# EAGLE design pdb_v2 (EAGLE 9.4.2)
Robot power distribution board v2.0. Provides stable 5V and 3.3V rails, a direct power output, and I2C expansion.
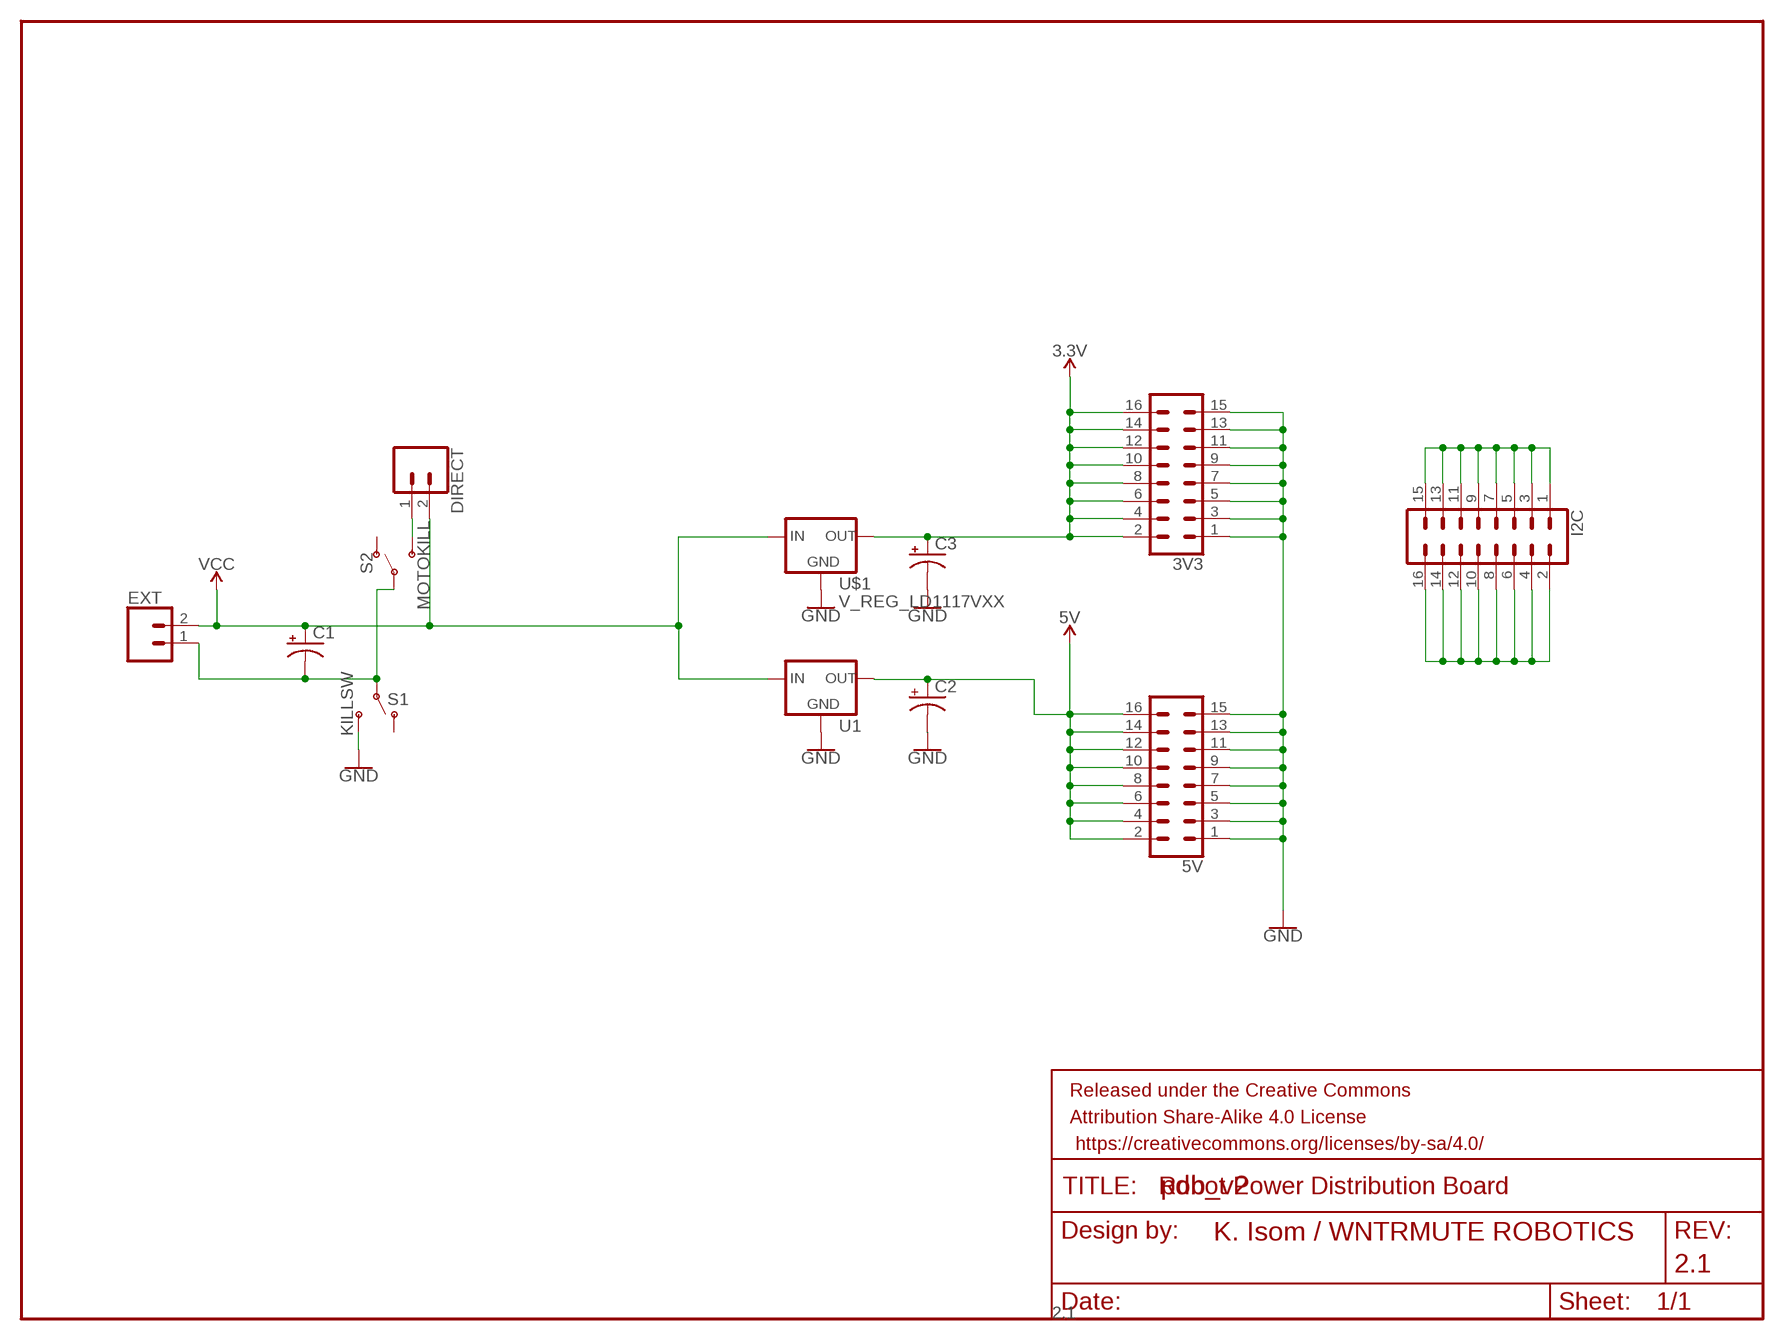
[diagram p0: schematic, sheet 1]

## Parts
3V3  CONN_08X2_HEADER  [2X8]
5V  CONN_08X2_HEADER  [2X8]
C1  1000µF  CPOL-USE5-10.5  [E5-10,5]
C2  100uF  CPOL-USE5-8.5  [E5-8,5]
C3  100uF  CPOL-USE5-8.5  [E5-8,5]
DIRECT  CONN_025MM  [SCREWTERMINAL-5MM-2]
EXT  CONN_025MM  [SCREWTERMINAL-5MM-2]
FRAME1  FRAME-LETTERNO_PACKAGE  [DUMMY]
I2C  CONN_08X2_HEADER  [2X8]
S1  KILLSW  SWITCH-SPDT-PTH-11.6X4.0MM-LOCK  [SWITCH_SPDT_PTH_11.6X4.0MM_LOCK]
S2  MOTOKILL  SWITCH-SPDT-PTH-11.6X4.0MM-LOCK  [SWITCH_SPDT_PTH_11.6X4.0MM_LOCK]
U1  V_REG_78XX-TO-220  [TO-220-ALT]
U$1  V_REG_LD1117VXX  [78XXL]

## Nets
3.3V: 3V3.2 3V3.4 3V3.6 3V3.8 3V3.10 3V3.12 3V3.14 3V3.16 C3.+ U$1.GND(OUT)
5V: 5V.2 5V.4 5V.6 5V.8 5V.10 5V.12 5V.14 5V.16 C2.+ U1.OUT
GND: 3V3.1 3V3.3 3V3.5 3V3.7 3V3.9 3V3.11 3V3.13 3V3.15 5V.1 5V.3 5V.5 5V.7 5V.9 5V.11 5V.13 5V.15 C2.- C3.- S1.3(S) U1.GND U$1.IN(GND)
N$1: C1.- EXT.1 S1.2(P) S2.2(P)
N$7: I2C.1 I2C.3 I2C.5 I2C.7 I2C.9 I2C.11 I2C.13 I2C.15
N$9: I2C.2 I2C.4 I2C.6 I2C.8 I2C.10 I2C.12 I2C.14 I2C.16
N$11: DIRECT.1 S2.3(S)
VCC: C1.+ DIRECT.2 EXT.2 U1.IN U$1.OUT(IN)
Unconnected: S1.1(O) S2.1(O)

## Notes on the sheet
- Robot Power Distribution Board

## Library data of the parts
3V3 5V I2C = SparkFun-Connectors:CONN_08X2: Multi connection point. Often used as Generic Header-pin footprint for 0.1 inch spaced/style header connections You can populate with any combo of single row headers, but if you'd like an exact match, check this: Header - 2x8 (Male, 0.1") <https://www.sparkfun.com/products/13156> (PRT-13156) On any of the 0.1 inch spaced packages, you can populate with these: Break Away Headers - Straight <https://www.sparkfun.com/products/116> (PRT-00116) Break Away Male Headers - Right Angle <https://www.sparkfun.com/products/553> (PRT-00553) Female Headers <https://www.sparkfun.com/products/115> (PRT-00115) Break Away Headers - Machine Pin <https://www.sparkfun.com/products/117> (PRT-00117) Break Away Female Headers - Swiss Machine Pin <https://www.sparkfun.com/products/743> (PRT-00743)
C1-C3 = rcl:CPOL-US: POLARIZED CAPACITOR, American symbol; SPICEPREFIX: C
DIRECT EXT = SparkFun-Connectors:CONN_02: Multi connection point. Often used as Generic Header-pin footprint for 0.1 inch spaced/style header connections On any of the 0.1 inch spaced packages, you can populate with these: Break Away Headers - Straight <https://www.sparkfun.com/products/116> (PRT-00116) Break Away Male Headers - Right Angle <https://www.sparkfun.com/products/553> (PRT-00553) Female Headers <https://www.sparkfun.com/products/115> (PRT-00115) Break Away Headers - Machine Pin <https://www.sparkfun.com/products/117> (PRT-00117) Break Away Female Headers - Swiss Machine Pin <https://www.sparkfun.com/products/743> (PRT-00743) For SCREWTERMINALS and SPRING TERMINALS visit here: Screw Terimnals on SparkFun.com <https://www.sparkfun.com/search/results?term=Screw+Terminals> (5mm/3.5mm/2.54mm spacing) This device is also useful as a general connection point to wire up your design to another part of your project. Our various solder wires solder well into these plated through hole pads. Hook-Up Wire - Assortment (Stranded, 22 AWG) <https://www.sparkfun.com/products/11375> (PRT-11375) Hook-Up Wire - Assortment (Solid Core, 22 AWG) <https://www.sparkfun.com/products/11367> (PRT-11367) View the entire wire category on our website here <https://www.sparkfun.com/categories/141> Special notes: Molex polarized connector foot print use with: PRT-08233 with associated crimp pins and housings. 2.54_SCREWTERM for use with PRT-10571. 3.5mm Screw Terminal footprints for PRT-08084 5mm Screw Terminal footprints for use with PRT-08432; SF_SKU: PRT-08432
FRAME1 = SparkFun-Aesthetics:FRAME-LETTER: Schematic Frame - Letter Standard 8.5x11 US Letter frame; DESIGNER: K. Isom / WNTRMUTE ROBOTICS; REV: 2.1; VERSION: 2.1
S1 S2 = SparkFun-Switches:SWITCH-SPDT: Single Pole, Double Throw (SPDT) Switch Single-pole, double-throw (SPDT) switch. Variant Overview SMD-AYZ0202 Surface Mount DPDT Switch <https://www.sparkfun.com/products/597> (COM-00597) Used on e.g. LilyPad Arduino USB - ATmega32U4 Board <https://www.sparkfun.com/products/12049> PTH-11.6X4.0MM SPDT Mini Power Switch <https://www.sparkfun.com/products/102> (COM-00102) Used on e.g. SparkFun Simon Says - Through-Hole Soldering Kit <https://www.sparkfun.com/products/10547> (KIT-10547) PTH-11.6X4.0MM-KIT KIT version of SPDT Mini Power Switch - Simplifies soldering by removing tStop of switch pins - only one side can be soldered. PTH-11.6X4.0MM-LOCK LOCK version of SPDT Mini Power Switch - Offset pins hold switch in place for easier soldering. SMD-RIGHT-ANGLE Surface Mount Right Angle Switch <https://www.sparkfun.com/products/10860> (COM-10860) Used on e.g. SparkFun ESP8266 Thing <https://www.sparkfun.com/products/13231>; PROD_ID: SWCH-08261; SF_SKU: COM-00102
U1 = SparkFun-IC-Power:V_REG_78XX: Voltage Regulator Standard 78xx regulator. IGO (Input Ground Output). Spark Fun Electronics SKU : COM-00107; PROD_ID: VREG-08450; SF_ID: COM-00107
U$1 = SparkFun-IC-Power:V_REG_LD1117VXX: LD1117VXX voltage regulator. We carry the 3.3V version (COM-00526) in TO-220 package.

## Board
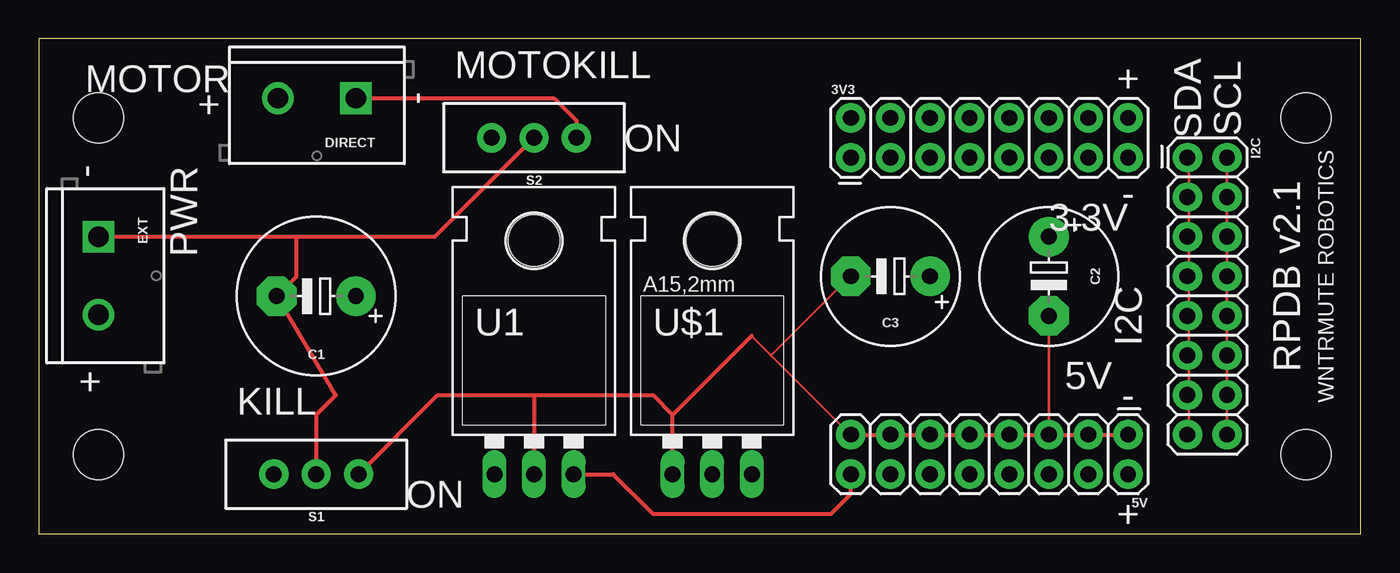
[diagram p1: board, top side]
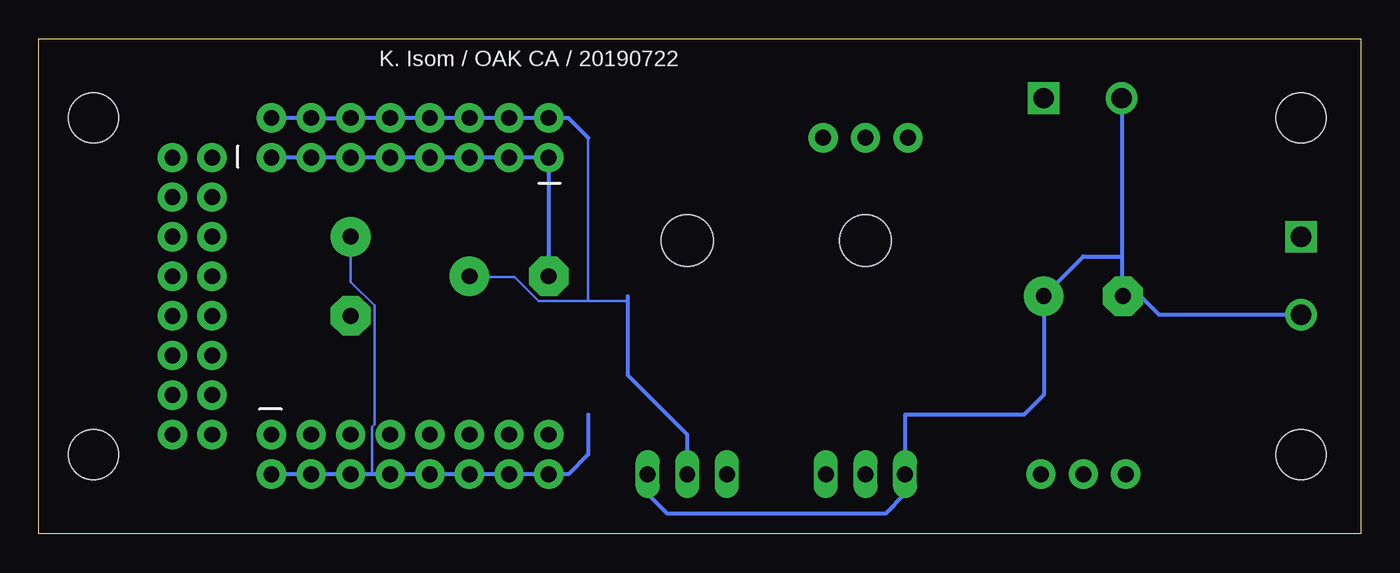
[diagram p2: board, bottom side, seen from below]

Size 84.76 x 31.74 mm. Coordinates in mm from the lower left corner, seen from the top.
Outline: 0,0 84.76,0 84.76,31.74 0,31.74 0,0
Copper layers (1*16): Top 0.035559375mm / dielectric 1.6mm / Bottom 0.035559375mm
Design rules "oshpark-2layer": minimum track width 6mil, minimum drill 10mil, track to track 6mil, track to pad 6mil, pad to pad 6mil, via to via 6mil, smd to smd 6mil, copper to edge 15mil, drill to drill 6mil, minimum pad ring 5mil, minimum via ring 5mil, stop-mask expansion 2.5mil, vias tented up to drill 0mil, thermal gap 10mil
Holes 3.2 mm at 3.81,26.67 3.81,5.08 81.28,5.08 81.28,26.67

### Footprints (pad centres in the part's own frame; a part is rotated, then mirrored left to right if it is on the bottom)
2X8 = drill 1.016 pad 1.88: 1 0,0; 2 0,2.54; 3 2.54,0; 4 2.54,2.54; 5 5.08,0; 6 5.08,2.54; 7 7.62,0; 8 7.62,2.54; 9 10.16,0; 10 10.16,2.54; 11 12.7,0; 12 12.7,2.54; 13 15.24,0; 14 15.24,2.54; 15 17.78,0; 16 17.78,2.54
E5-10,5 = drill 1.016 pad 2.54: + -2.54,0 | drill 1.016 pad 2.54 octagon: - 2.54,0
E5-8,5 = drill 1.016 pad 2.54: + -2.54,0 | drill 1.016 pad 2.54 octagon: - 2.54,0
SCREWTERMINAL-5MM-2 = drill 1.3 pad 2.032 square: 1 0,0 | drill 1.3 pad 2.032: 2 5,0
SWITCH_SPDT_PTH_11.6X4.0MM_LOCK = drill 1.016 pad 1.88: 1 0,2.718; 2 0,0; 3 0,-2.718
TO-220-ALT = drill 1.016 long: GND 0,-3.81; IN -2.54,-3.81; OUT 2.54,-3.81 | hole 3.302: 0,11.176
78XXL = drill 1.016 long: GND 0,-3.81; IN -2.54,-3.81; OUT 2.54,-3.81 | hole 3.302: 0,11.176

### Placement (x,y rotation side)
3V3  52.07,24.13 0 top
5V  69.85,6.35 180 top
C1  17.78,15.24 180 top
C2  64.77,16.51 270 top
C3  54.61,16.51 180 top
DIRECT  20.32,27.94 180 top
EXT  3.81,19.05 270 top
FRAME1  0,-1.27 0 top
I2C  73.66,24.13 270 top
S1  17.78,3.81 90 top
S2  31.75,25.4 90 top
U1  31.75,7.62 0 top
U$1  43.18,7.62 0 top

### Tracks (layer width: path | path; a pad name or v marks a point on that pad's centre or on a via)
3.3V
  Bottom 0.152: 46.99,14.94 49.53,14.94 | 49.53,14.94 52.73,14.94 54.25,16.46 57.15,16.46 C3.+ | 49.53,25.4 49.53,14.94
  Bottom 0.254: U$1.GND 43.18,6.35 46.99,10.16 46.99,14.94 46.99,15.22 | 49.53,25.4 50.8,26.67 3V3.2 3V3.4 3V3.6 3V3.8 3V3.10 3V3.12 3V3.14 3V3.16
5V
  Top 0.254: U1.OUT 36.83,3.81 39.37,1.27 50.8,1.27 52.07,2.54 5V.16
  Bottom 0.152: C2.+ 64.77,16.15 63.25,14.63 63.25,7.01 63.4,6.86 63.4,3.81
  Bottom 0.254: 49.53,7.62 49.53,5.08 50.8,3.81 5V.16 5V.14 5V.12 5V.10 5V.8 63.4,3.81 5V.6 5V.4 5V.2
GND
  Top 0.152: 5V.5 C2.- | 45.7,12.68 46.94,11.43 | 46.94,11.43 51.97,6.4 5V.15 | 46.94,11.43 51.97,16.46 C3.-
  Top 0.254: S1.3 25.58,8.89 31.75,8.89 | 31.75,8.89 U1.GND | U$1.IN 40.64,7.62 | 40.64,7.62 45.7,12.68 45.72,12.7 | 5V.15 5V.13 5V.11 5V.9 5V.7 5V.5 5V.3 5V.1 | 40.64,7.62 39.37,8.89 31.75,8.89
  Bottom 0.254: 3V3.15 3V3.13 3V3.11 3V3.9 3V3.7 3V3.5 3V3.3 3V3.1 C3.-
N$1
  Top 0.254: EXT.1 16.51,19.05 | 16.51,19.05 25.4,19.05 S2.2 | S1.2 17.78,7.62 19.03,8.87 C1.- 16.51,16.51 16.51,19.05
N$7
  Top 0.152: I2C.1 73.76,24.08 73.76,21.64 I2C.3 73.76,21.49 73.76,19.05 | 73.76,19.05 73.76,16.61 I2C.7 73.76,16.46 73.76,14.02 I2C.9 73.76,13.87 73.76,11.43 | I2C.15 73.76,6.4 73.76,8.84 I2C.13 73.76,8.99 73.76,11.43 | 73.76,11.43 I2C.11 | 73.76,19.05 I2C.5
N$9
  Top 0.152: I2C.2 I2C.4 I2C.6 I2C.8 I2C.10 I2C.12 I2C.14 I2C.16
N$11
  Top 0.254: DIRECT.1 33.02,27.94 34.47,26.49 S2.3
VCC
  Bottom 0.254: DIRECT.2 15.32,17.78 | 15.32,17.78 15.32,16.45 12.92,14.05 EXT.2 | U$1.OUT 45.72,2.54 44.45,1.27 30.48,1.27 29.21,2.54 U1.IN 29.21,7.62 21.59,7.62 20.32,8.89 C1.+ 17.78,17.78 15.32,17.78

### Text on the board
tPlace: MOTOR | MOTOKILL | + | - | SDA | SCL | + | ON | - | - | 3.3V | PWR | RPDB v2.1 | WNTRMUTE ROBOTICS | I2C | 5V | + | - | KILL | ON | +
bPlace: K. Isom / OAK CA / 20190722
Holes: -